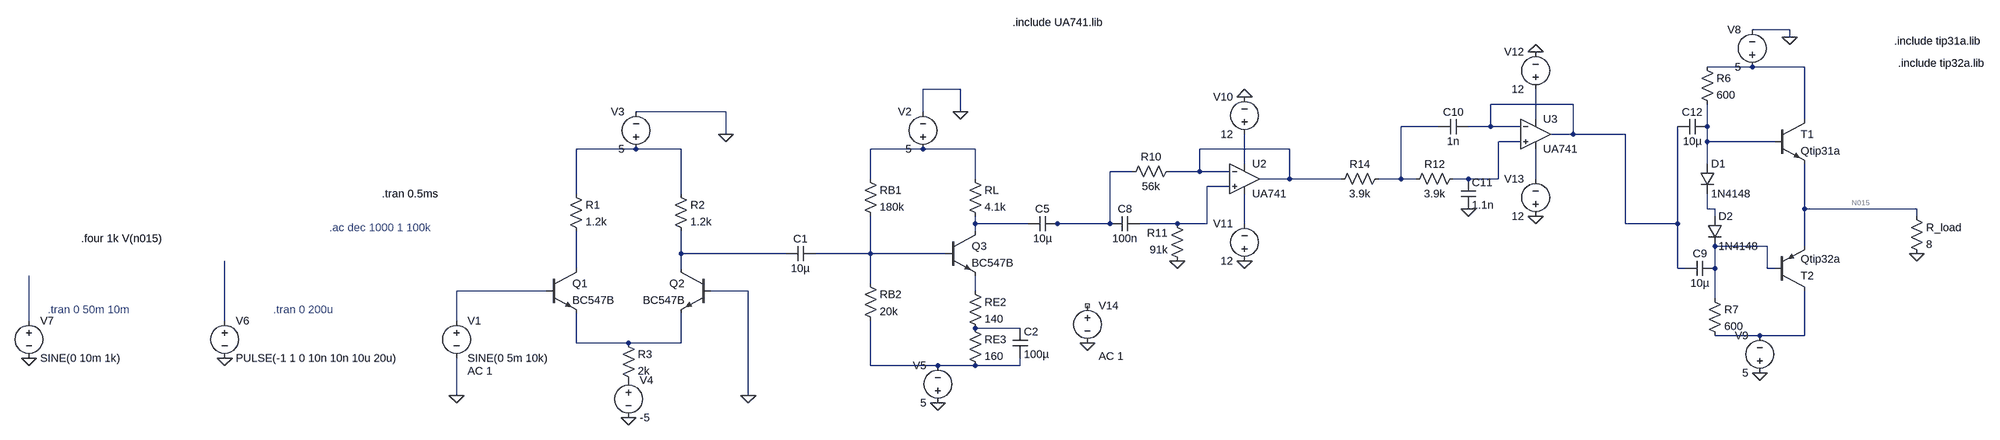
[diagram p0: schematic audio_amp_final_s3.asc]
audio_amp_final_s3.asc, the LTspice schematic file:
Version 4
SHEET 1 5068 3472
WIRE 3120 -384 3040 -384
WIRE 3120 -368 3120 -384
WIRE 3040 -304 2944 -304
WIRE 3152 -304 3040 -304
WIRE 1216 -256 1136 -256
WIRE 2560 -224 2384 -224
WIRE 576 -208 384 -208
WIRE 1136 -208 1136 -256
WIRE 1216 -208 1216 -256
WIRE 2480 -192 2480 -256
WIRE 3152 -192 3152 -304
WIRE 2272 -176 2192 -176
WIRE 2384 -176 2384 -224
WIRE 2384 -176 2336 -176
WIRE 2448 -176 2384 -176
WIRE 2944 -176 2944 -224
WIRE 576 -160 576 -208
WIRE 2560 -160 2560 -224
WIRE 2560 -160 2512 -160
WIRE 2672 -160 2560 -160
WIRE 2448 -144 2400 -144
WIRE 2944 -144 2944 -176
WIRE 3088 -144 2944 -144
WIRE 384 -128 256 -128
WIRE 480 -128 384 -128
WIRE 1136 -128 1024 -128
WIRE 1248 -128 1136 -128
WIRE 1920 -128 1728 -128
WIRE 1824 -96 1824 -160
WIRE 2944 -96 2944 -144
WIRE 1584 -80 1536 -80
WIRE 1728 -80 1728 -128
WIRE 1728 -80 1664 -80
WIRE 1792 -80 1728 -80
WIRE 1024 -64 1024 -128
WIRE 1248 -64 1248 -128
WIRE 1920 -64 1920 -128
WIRE 1920 -64 1856 -64
WIRE 2064 -64 1920 -64
WIRE 2192 -64 2192 -176
WIRE 2192 -64 2144 -64
WIRE 2224 -64 2192 -64
WIRE 2336 -64 2304 -64
WIRE 2400 -64 2400 -144
WIRE 2400 -64 2336 -64
WIRE 2480 -64 2480 -128
WIRE 1792 -48 1744 -48
WIRE 256 -32 256 -128
WIRE 480 -32 480 -128
WIRE 2944 0 2944 -32
WIRE 2960 0 2944 0
WIRE 3152 0 3152 -96
WIRE 3392 0 3152 0
WIRE 2960 16 2960 0
WIRE 3392 16 3392 0
WIRE 1248 32 1248 16
WIRE 1360 32 1248 32
WIRE 1424 32 1408 32
WIRE 1536 32 1536 -80
WIRE 1536 32 1424 32
WIRE 1680 32 1600 32
WIRE 1744 32 1744 -48
WIRE 1744 32 1680 32
WIRE 1824 32 1824 -32
WIRE 2672 32 2672 -160
WIRE 2880 32 2880 -176
WIRE 2880 32 2672 32
WIRE 1248 48 1248 32
WIRE 3072 80 2960 80
WIRE 3152 80 3152 0
WIRE 480 96 480 48
WIRE 704 96 480 96
WIRE 1024 96 1024 16
WIRE 1024 96 768 96
WIRE 1184 96 1024 96
WIRE 256 128 256 48
WIRE 480 128 480 96
WIRE 2880 128 2880 32
WIRE 2896 128 2880 128
WIRE 2960 128 2960 80
WIRE 3072 128 3072 80
WIRE 3088 128 3072 128
WIRE 1024 160 1024 96
WIRE 192 176 0 176
WIRE 624 176 544 176
WIRE 1248 176 1248 144
WIRE 2960 192 2960 128
WIRE -928 240 -928 144
WIRE -496 240 -496 112
WIRE 0 240 0 176
WIRE 1344 256 1248 256
WIRE 3056 272 2960 272
WIRE 3152 272 3152 176
WIRE 3152 272 3056 272
WIRE 256 288 256 224
WIRE 368 288 256 288
WIRE 480 288 480 224
WIRE 480 288 368 288
WIRE 1024 336 1024 240
WIRE 1168 336 1024 336
WIRE 1248 336 1168 336
WIRE 1344 336 1344 320
WIRE 1344 336 1248 336
WIRE 0 400 0 320
WIRE 624 400 624 176
FLAG 0 400 0
FLAG 624 400 0
FLAG 368 448 0
FLAG 576 -160 0
FLAG 1216 -208 0
FLAG 1168 416 0
FLAG 3392 96 0
FLAG 3056 352 0
FLAG 3120 -368 0
FLAG 1824 -240 0
FLAG 1824 112 0
FLAG 2480 -336 0
FLAG 2480 16 0
FLAG 1680 112 0
FLAG 2336 0 0
FLAG -496 320 0
FLAG -928 320 0
FLAG 1488 288 0
SYMBOL npn 192 128 R0
SYMATTR InstName Q1
SYMATTR Value BC547B
SYMBOL npn 544 128 M0
SYMATTR InstName Q2
SYMATTR Value BC547B
SYMBOL voltage 0 224 R0
WINDOW 123 24 124 Left 2
WINDOW 39 0 0 Left 0
SYMATTR Value2 AC 1
SYMATTR InstName V1
SYMATTR Value SINE(0 5m 10k)
SYMBOL res 240 -48 R0
SYMATTR InstName R1
SYMATTR Value 1.2k
SYMBOL res 464 -48 R0
SYMATTR InstName R2
SYMATTR Value 1.2k
SYMBOL voltage 384 -112 R180
WINDOW 0 24 96 Left 2
WINDOW 3 24 16 Left 2
WINDOW 123 0 0 Left 0
WINDOW 39 0 0 Left 0
SYMATTR InstName V3
SYMATTR Value 5
SYMBOL res 352 272 R0
SYMATTR InstName R3
SYMATTR Value 2k
SYMBOL voltage 368 352 R0
WINDOW 123 0 0 Left 0
WINDOW 39 0 0 Left 0
SYMATTR InstName V4
SYMATTR Value -5
SYMBOL cap 768 80 R90
WINDOW 0 0 32 VBottom 2
WINDOW 3 32 32 VTop 2
SYMATTR InstName C1
SYMATTR Value 10µ
SYMBOL res 1008 -80 R0
SYMATTR InstName RB1
SYMATTR Value 180k
SYMBOL res 1232 -80 R0
SYMATTR InstName RL
SYMATTR Value 4.1k
SYMBOL npn 1184 48 R0
SYMATTR InstName Q3
SYMATTR Value BC547B
SYMBOL res 1008 144 R0
SYMATTR InstName RB2
SYMATTR Value 20k
SYMBOL voltage 1136 -112 R180
WINDOW 0 24 96 Left 2
WINDOW 3 24 16 Left 2
WINDOW 123 0 0 Left 0
WINDOW 39 0 0 Left 0
SYMATTR InstName V2
SYMATTR Value 5
SYMBOL res 1232 160 R0
SYMATTR InstName RE2
SYMATTR Value 140
SYMBOL cap 1328 256 R0
SYMATTR InstName C2
SYMATTR Value 100µ
SYMBOL res 1232 240 R0
SYMATTR InstName RE3
SYMATTR Value 160
SYMBOL cap 1424 16 R90
WINDOW 0 0 32 VBottom 2
WINDOW 3 32 32 VTop 2
SYMATTR InstName C5
SYMATTR Value 10µ
SYMBOL diode 2928 -96 R0
SYMATTR InstName D1
SYMATTR Value 1N4148
SYMBOL diode 2944 16 R0
SYMATTR InstName D2
SYMATTR Value 1N4148
SYMBOL res 2928 -320 R0
SYMATTR InstName R6
SYMATTR Value 600
SYMBOL res 2944 176 R0
SYMATTR InstName R7
SYMATTR Value 600
SYMBOL npn 3088 -192 R0
SYMATTR InstName T1
SYMATTR Value Qtip31a
SYMBOL pnp 3088 176 M180
SYMATTR InstName T2
SYMATTR Value Qtip32a
SYMBOL res 3376 0 R0
SYMATTR InstName R_load
SYMATTR Value 8
SYMBOL voltage 3040 -288 R180
WINDOW 0 24 96 Left 2
WINDOW 3 24 16 Left 2
WINDOW 123 0 0 Left 0
WINDOW 39 0 0 Left 0
SYMATTR InstName V8
SYMATTR Value 5
SYMBOL voltage 3056 368 R180
WINDOW 0 24 96 Left 2
WINDOW 3 24 16 Left 2
WINDOW 123 0 0 Left 0
WINDOW 39 0 0 Left 0
SYMATTR InstName V9
SYMATTR Value 5
SYMBOL voltage 1168 432 R180
WINDOW 0 24 96 Left 2
WINDOW 3 24 16 Left 2
WINDOW 123 0 0 Left 0
WINDOW 39 0 0 Left 0
SYMATTR InstName V5
SYMATTR Value 5
SYMBOL OpAmps\\opamp2 1824 -128 R0
SYMATTR InstName U2
SYMATTR Value UA741
SYMBOL voltage 1824 -144 R180
WINDOW 0 24 96 Left 2
WINDOW 3 24 16 Left 2
WINDOW 123 0 0 Left 0
WINDOW 39 0 0 Left 0
SYMATTR InstName V10
SYMATTR Value 12
SYMBOL voltage 1824 128 R180
WINDOW 0 24 96 Left 2
WINDOW 3 24 16 Left 2
SYMATTR InstName V11
SYMATTR Value 12
SYMBOL OpAmps\\opamp2 2480 -224 R0
SYMATTR InstName U3
SYMATTR Value UA741
SYMBOL voltage 2480 -240 R180
WINDOW 0 24 96 Left 2
WINDOW 3 24 16 Left 2
SYMATTR InstName V12
SYMATTR Value 12
SYMBOL voltage 2480 32 R180
WINDOW 0 24 96 Left 2
WINDOW 3 24 16 Left 2
WINDOW 123 0 0 Left 0
WINDOW 39 0 0 Left 0
SYMATTR InstName V13
SYMATTR Value 12
SYMBOL res 1680 -96 R90
WINDOW 0 0 56 VBottom 2
WINDOW 3 32 56 VTop 2
SYMATTR InstName R10
SYMATTR Value 56k
SYMBOL res 1696 128 R180
WINDOW 0 36 76 Left 2
WINDOW 3 36 40 Left 2
SYMATTR InstName R11
SYMATTR Value 91k
SYMBOL cap 1600 16 R90
WINDOW 0 0 32 VBottom 2
WINDOW 3 32 32 VTop 2
SYMATTR InstName C8
SYMATTR Value 100n
SYMBOL cap 2336 -192 R90
WINDOW 0 0 32 VBottom 2
WINDOW 3 32 32 VTop 2
SYMATTR InstName C10
SYMATTR Value 1n
SYMBOL cap 2320 -64 R0
SYMATTR InstName C11
SYMATTR Value 1.1n
SYMBOL res 2320 -80 R90
WINDOW 0 0 56 VBottom 2
WINDOW 3 32 56 VTop 2
SYMATTR InstName R12
SYMATTR Value 3.9k
SYMBOL res 2160 -80 R90
WINDOW 0 0 56 VBottom 2
WINDOW 3 32 56 VTop 2
SYMATTR InstName R14
SYMATTR Value 3.9k
SYMBOL cap 2960 112 R90
WINDOW 0 0 32 VBottom 2
WINDOW 3 32 32 VTop 2
SYMATTR InstName C9
SYMATTR Value 10µ
SYMBOL cap 2944 -192 R90
WINDOW 0 0 32 VBottom 2
WINDOW 3 32 32 VTop 2
SYMATTR InstName C12
SYMATTR Value 10µ
SYMBOL voltage -496 224 R0
WINDOW 123 0 0 Left 0
WINDOW 39 0 0 Left 0
SYMATTR InstName V6
SYMATTR Value PULSE(-1 1 0 10n 10n 10u 20u)
SYMBOL voltage -928 224 R0
WINDOW 123 0 0 Left 0
WINDOW 39 0 0 Left 0
SYMATTR InstName V7
SYMATTR Value SINE(0 10m 1k)
SYMBOL voltage 1488 192 R0
WINDOW 123 24 124 Left 2
WINDOW 39 0 0 Left 0
SYMATTR Value2 AC 1
SYMATTR InstName V14
SYMATTR Value ""
TEXT -160 -32 Left 2 !.tran 0.5ms
TEXT 1328 -400 Left 2 !.include UA741.lib
TEXT 3344 -360 Left 2 !.include tip31a.lib
TEXT 3352 -312 Left 2 !.include tip32a.lib
TEXT -272 40 Left 2 ;.ac dec 1000 1 100k
TEXT -392 216 Left 2 ;.tran 0 200u
TEXT -888 216 Left 2 ;.tran 0 50m 10m
TEXT -816 64 Left 2 !.four 1k V(n015)

The netlist it stands for:
* audio_amp_final_s3.asc
Q1 N021 N022 N028 0 BC547B
Q2 N019 0 N028 0 BC547B
V1 N022 0 SINE(0 5m 10k) AC 1
R1 N007 N021 1.2k
R2 N007 N019 1.2k
V3 N007 0 5
R3 N028 P001 2k
V4 P001 0 -5
C1 N020 N019 10µ
RB1 N008 N020 180k
RL N008 N016 4.1k
Q3 N016 N020 N023 0 BC547B
RB2 N020 N029 20k
V2 N008 0 5
RE2 N023 N026 140
C2 N026 N029 100µ
RE3 N026 N029 160
C5 N011 N016 10µ
D1 N005 N014 1N4148
D2 N014 N018 1N4148
R6 N001 N005 600
R7 N018 N027 600
Q§T1 N001 N005 N015 0 Qtip31a
Q§T2 N027 N018 N015 0 Qtip32a
R_load N015 0 8
V8 N001 0 5
V9 0 N027 5
V5 0 N029 5
XU2 N013 N009 N010 N017 N009 UA741  ; pins In+ In- V+ V- OUT
V10 N010 0 12
V11 0 N017 12
XU3 N006 N002 N003 N012 N002 UA741  ; pins In+ In- V+ V- OUT
V12 N003 0 12
V13 0 N012 12
R10 N009 N011 56k
R11 0 N013 91k
C8 N013 N011 100n
C10 N002 N004 1n
C11 N006 0 1.1n
R12 N006 N004 3.9k
R14 N004 N009 3.9k
C9 N018 N002 10µ
C12 N005 N002 10µ
V6 N025 0 PULSE(-1 1 0 10n 10n 10u 20u)
V7 N024 0 SINE(0 10m 1k)
V14 NC_01 0 AC 1
.model D D
.lib standard.dio
.model NPN NPN
.model PNP PNP
.lib standard.bjt
.tran 0.5ms
.include UA741.lib
.include tip31a.lib
.include tip32a.lib
* .ac dec 1000 1 100k
* .tran 0 200u
* .tran 0 50m 10m
.four 1k V(n015)
.backanno
.end